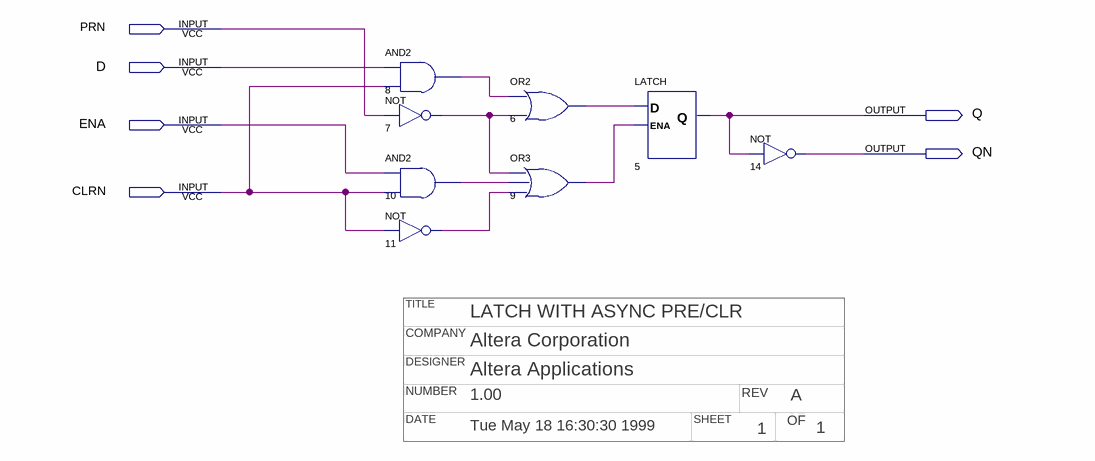
[diagram p0: schematic sheet]
// Quartus schematic ltch_p_c.bdf as structural Verilog: 8 symbols, 6 pins
// Title block: TITLE: LATCH WITH ASYNC PRE/CLR; COMPANY: Altera Corporation; DESIGNER: Altera Applications; NUMBER: 1.00; REV: A; DATE: Tue May 18 16:30:30 1999; SHEET: 1; OF: 1
module ltch_p_c (
  input  PRN,
  input  D,
  input  ENA,
  input  CLRN,
  output Q,
  output QN
);

  wire n6_out, n7_out, n8_out, n9_out, n10_out, n11_out;

  and u_8 (n8_out, D, CLRN);
  not u_7 (n7_out, PRN);
  and u_10 (n10_out, ENA, CLRN);
  not u_11 (n11_out, CLRN);
  or u_6 (n6_out, n8_out, n7_out);
  or u_9 (n9_out, n7_out, n10_out, n11_out);
  LATCH u_5 (.D(n6_out), .ENA(n9_out), .Q(Q));
  not u_14 (QN, Q);
endmodule
